# Altium schematic sheet 02_Power_Diagram.SchDoc: Power diagram
size A4; Organization: Lime Microsystems; Address1: Surrey Tech Centre; Address2: Guildford GU2 7YG; Address3: Surrey; Address4: United Kingdom; SheetNumber: 2
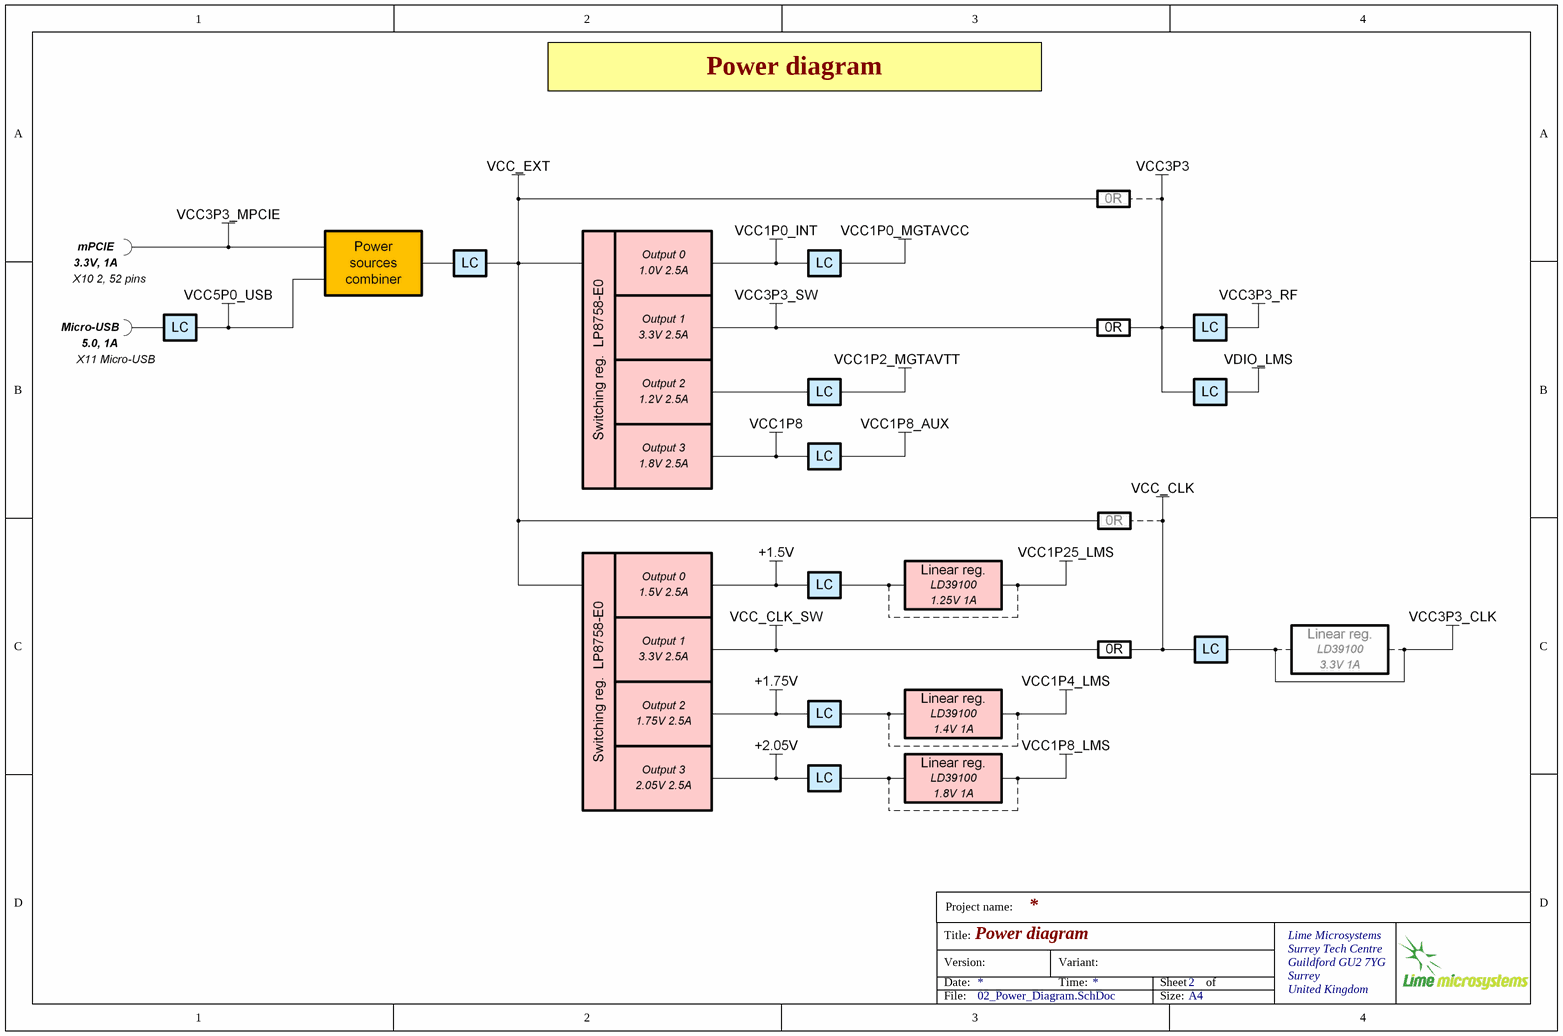
[diagram p0: 02_Power_Diagram.SchDoc]

## Notes on the sheet
- Power diagram
- Project name:
- Title:
- Version:
- Date:
- Variant:
- Time:
- Sheet
- of
- File:
- Size:
- A4